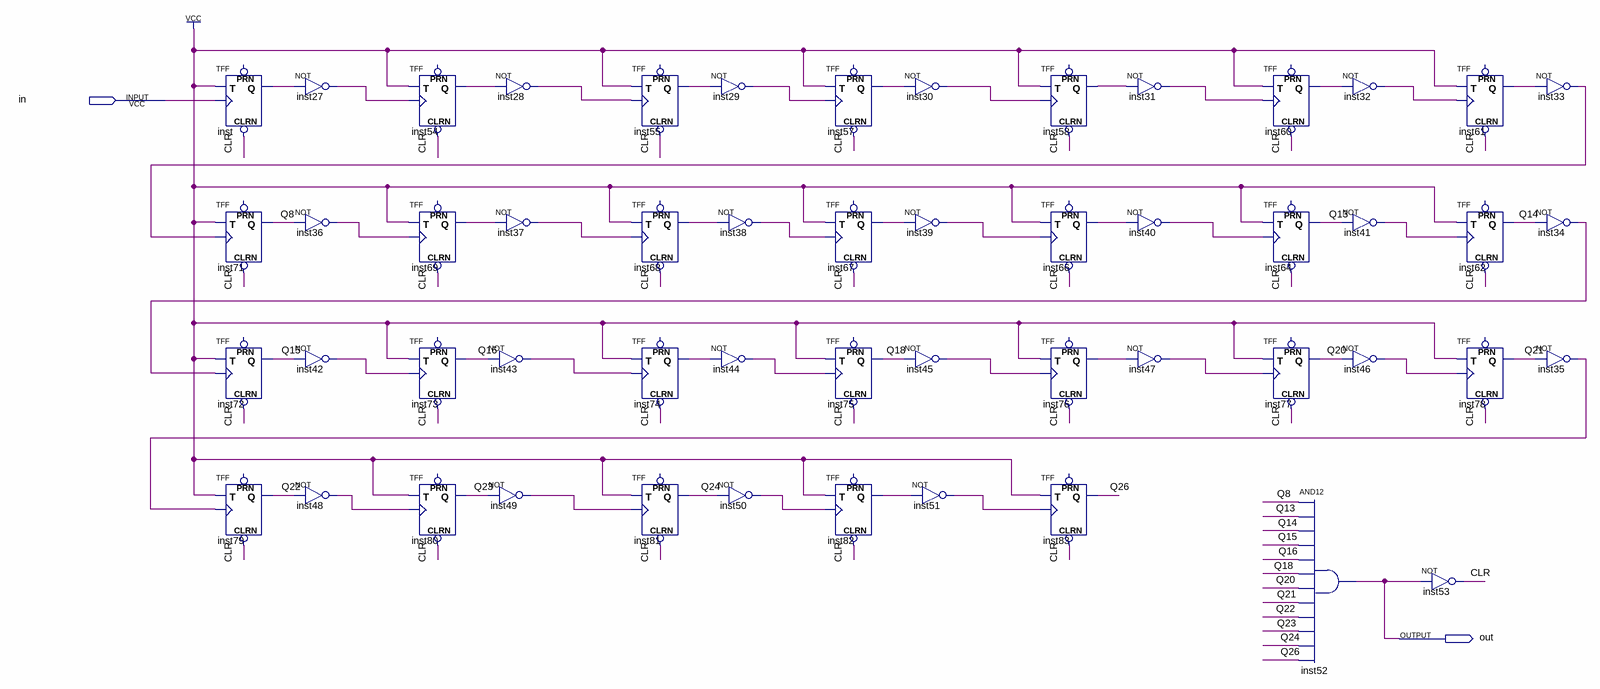
[diagram p0: schematic sheet]
// Quartus schematic frequencyDiv.bdf as structural Verilog: 53 symbols, 2 pins
module frequencyDiv (
  input  in,
  output out
);

  wire CLR, inst27_out, inst28_out, inst29_out, inst30_out, inst31_out, inst32_out, inst33_out, inst34_out,
       inst35_out, inst36_out, inst37_out, inst38_out, inst39_out, inst40_out, inst41_out, inst42_out,
       inst43_out, inst44_out, inst45_out, inst46_out, inst47_out, inst48_out, inst49_out, inst50_out,
       inst51_out, inst54_q, inst55_q, inst57_q, inst58_q, inst60_q, inst61_q, inst66_q, inst67_q, inst68_q,
       inst69_q, inst74_q, inst76_q, inst82_q, inst_q, Q8, Q13, Q14, Q15, Q16, Q18, Q20, Q21, Q22, Q23, Q24,
       Q26;

  TFF inst (.CLRN(CLR), .T(1'b1), .CLK(in), .Q(inst_q));  // open: PRN
  TFF inst71 (.CLRN(CLR), .T(1'b1), .CLK(inst33_out), .Q(Q8));  // open: PRN
  TFF inst72 (.CLRN(CLR), .T(1'b1), .CLK(inst34_out), .Q(Q15));  // open: PRN
  TFF inst79 (.CLRN(CLR), .T(1'b1), .CLK(inst35_out), .Q(Q22));  // open: PRN
  not inst27 (inst27_out, inst_q);
  not inst36 (inst36_out, Q8);
  not inst42 (inst42_out, Q15);
  not inst48 (inst48_out, Q22);
  TFF inst54 (.CLRN(CLR), .T(1'b1), .CLK(inst27_out), .Q(inst54_q));  // open: PRN
  TFF inst69 (.CLRN(CLR), .T(1'b1), .CLK(inst36_out), .Q(inst69_q));  // open: PRN
  TFF inst73 (.CLRN(CLR), .T(1'b1), .CLK(inst42_out), .Q(Q16));  // open: PRN
  TFF inst80 (.CLRN(CLR), .T(1'b1), .CLK(inst48_out), .Q(Q23));  // open: PRN
  not inst28 (inst28_out, inst54_q);
  not inst37 (inst37_out, inst69_q);
  not inst43 (inst43_out, Q16);
  not inst49 (inst49_out, Q23);
  TFF inst55 (.CLRN(CLR), .T(1'b1), .CLK(inst28_out), .Q(inst55_q));  // open: PRN
  TFF inst68 (.CLRN(CLR), .T(1'b1), .CLK(inst37_out), .Q(inst68_q));  // open: PRN
  TFF inst74 (.CLRN(CLR), .T(1'b1), .CLK(inst43_out), .Q(inst74_q));  // open: PRN
  TFF inst81 (.CLRN(CLR), .T(1'b1), .CLK(inst49_out), .Q(Q24));  // open: PRN
  not inst29 (inst29_out, inst55_q);
  not inst38 (inst38_out, inst68_q);
  not inst44 (inst44_out, inst74_q);
  not inst50 (inst50_out, Q24);
  TFF inst57 (.CLRN(CLR), .T(1'b1), .CLK(inst29_out), .Q(inst57_q));  // open: PRN
  TFF inst67 (.CLRN(CLR), .T(1'b1), .CLK(inst38_out), .Q(inst67_q));  // open: PRN
  TFF inst75 (.CLRN(CLR), .T(1'b1), .CLK(inst44_out), .Q(Q18));  // open: PRN
  TFF inst82 (.CLRN(CLR), .T(1'b1), .CLK(inst50_out), .Q(inst82_q));  // open: PRN
  not inst30 (inst30_out, inst57_q);
  not inst39 (inst39_out, inst67_q);
  not inst45 (inst45_out, Q18);
  not inst51 (inst51_out, inst82_q);
  TFF inst58 (.CLRN(CLR), .T(1'b1), .CLK(inst30_out), .Q(inst58_q));  // open: PRN
  TFF inst66 (.CLRN(CLR), .T(1'b1), .CLK(inst39_out), .Q(inst66_q));  // open: PRN
  TFF inst76 (.CLRN(CLR), .T(1'b1), .CLK(inst45_out), .Q(inst76_q));  // open: PRN
  TFF inst83 (.CLRN(CLR), .T(1'b1), .CLK(inst51_out), .Q(Q26));  // open: PRN
  not inst31 (inst31_out, inst58_q);
  not inst40 (inst40_out, inst66_q);
  not inst47 (inst47_out, inst76_q);
  TFF inst60 (.CLRN(CLR), .T(1'b1), .CLK(inst31_out), .Q(inst60_q));  // open: PRN
  TFF inst64 (.CLRN(CLR), .T(1'b1), .CLK(inst40_out), .Q(Q13));  // open: PRN
  TFF inst77 (.CLRN(CLR), .T(1'b1), .CLK(inst47_out), .Q(Q20));  // open: PRN
  and inst52 (out, Q8, Q13, Q14, Q15, Q16, Q18, Q20, Q21, Q22, Q23, Q24, Q26);
  not inst32 (inst32_out, inst60_q);
  not inst41 (inst41_out, Q13);
  not inst46 (inst46_out, Q20);
  not inst53 (CLR, out);
  TFF inst61 (.CLRN(CLR), .T(1'b1), .CLK(inst32_out), .Q(inst61_q));  // open: PRN
  TFF inst62 (.CLRN(CLR), .T(1'b1), .CLK(inst41_out), .Q(Q14));  // open: PRN
  TFF inst78 (.CLRN(CLR), .T(1'b1), .CLK(inst46_out), .Q(Q21));  // open: PRN
  not inst33 (inst33_out, inst61_q);
  not inst34 (inst34_out, Q14);
  not inst35 (inst35_out, Q21);
endmodule
